# EAGLE schematic camera (EAGLE 6.5.0)
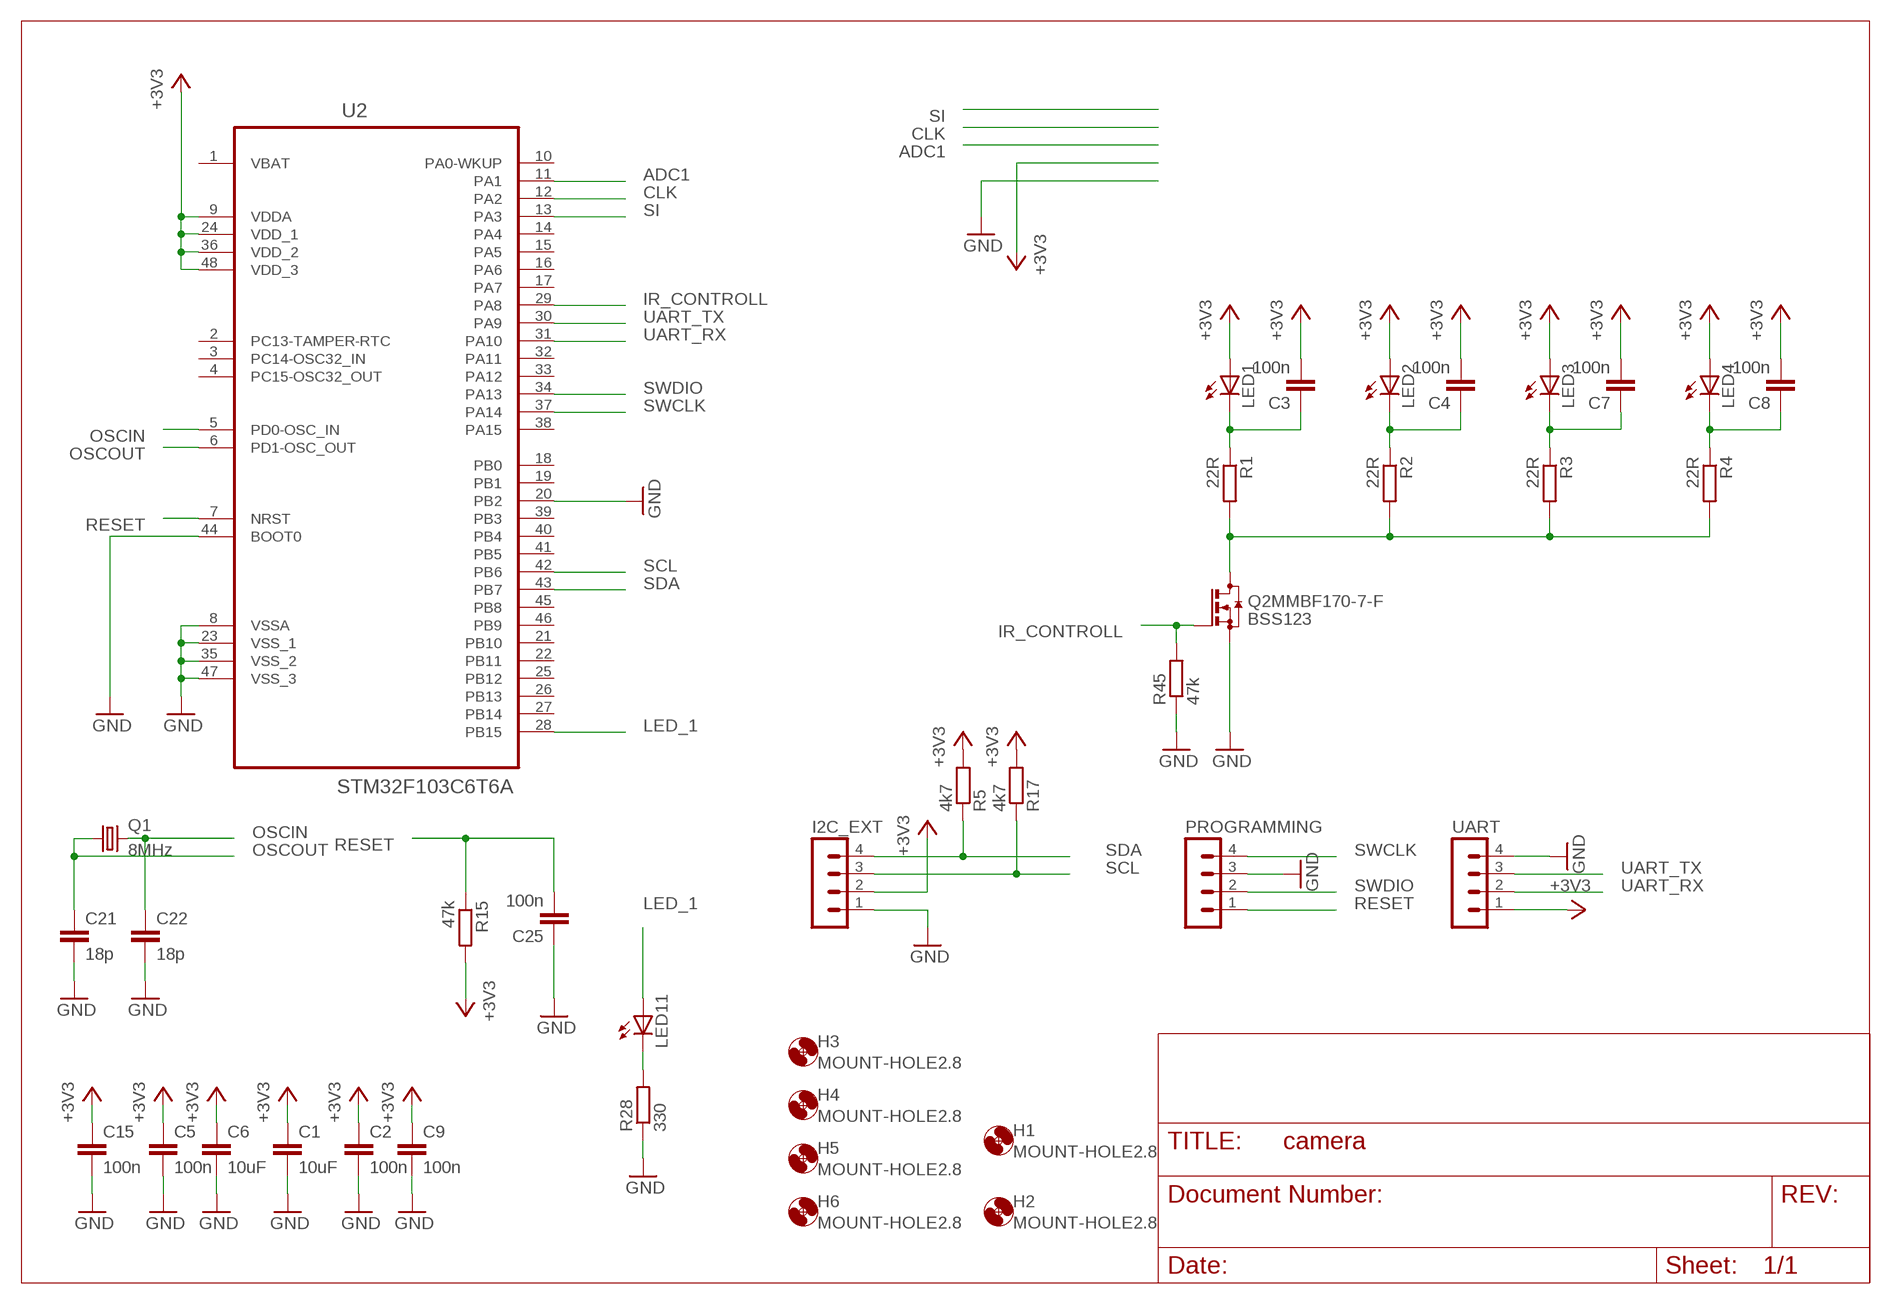
[diagram p0: schematic, sheet 1]

## Parts
C1  10uF  C-EUC0805  [C0805]
C2  100n  C-EUC0805  [C0805]
C3  100n  C-EUC0805  [C0805]
C4  100n  C-EUC0805  [C0805]
C5  100n  C-EUC0805  [C0805]
C6  10uF  C-EUC0805  [C0805]
C7  100n  C-EUC0805  [C0805]
C8  100n  C-EUC0805  [C0805]
C9  100n  C-EUC0805  [C0805]
C15  100n  C-EUC0805  [C0805]
C21  18p  C-EUC0805  [C0805]
C22  18p  C-EUC0805  [C0805]
C25  100n  C-EUC0805  [C0805]
H1  MOUNT-HOLE2.8  [2,8]
H2  MOUNT-HOLE2.8  [2,8]
H3  MOUNT-HOLE2.8  [2,8]
H4  MOUNT-HOLE2.8  [2,8]
H5  MOUNT-HOLE2.8  [2,8]
H6  MOUNT-HOLE2.8  [2,8]
I2C_EXT  MA04-1  [MA04-1]
LED1  LED5MM  [LED5MM]
LED2  LED5MM  [LED5MM]
LED3  LED5MM  [LED5MM]
LED4  LED5MM  [LED5MM]
LED11  LEDCHIPLED_1206  [CHIPLED_1206]
PROGRAMMING  MA04-1  [MA04-1]
Q1  8MHz  CRYSTALCTS406  [CTS406]
Q2MMBF170-7-F  BSS123  [SOT23]
R1  22R  R-EU_M0805  [M0805]
R2  22R  R-EU_M0805  [M0805]
R3  22R  R-EU_M0805  [M0805]
R4  22R  R-EU_M0805  [M0805]
R5  4k7  R-EU_M0805  [M0805]
R15  47k  R-EU_M0805  [M0805]
R17  4k7  R-EU_M0805  [M0805]
R28  330  R-EU_M0805  [M0805]
R45  47k  R-EU_M0805  [M0805]
U2  STM32F103C6T6A  [QFP50P900X900X160-48N]
UART  MA04-1  [MA04-1]

## Nets
+3V3: C1.1 C2.1 C3.2 C4.2 C5.1 C6.1 C7.2 C8.2 C9.1 C15.1 I2C_EXT.2 LED1.A LED2.A LED3.A LED4.A R5.2 R15.2 R17.2 U2.9(VDDA) U2.24(VDD_1) U2.36(VDD_2) U2.48(VDD_3) UART.1
ADC1: U2.11(PA1)
CLK: U2.12(PA2)
GND: C1.2 C2.2 C5.2 C6.2 C9.2 C15.2 C21.2 C22.2 C25.1 I2C_EXT.1 PROGRAMMING.3 Q2MMBF170-7-F.2(S) R28.1 R45.1 U2.8(VSSA) U2.20(PB2) U2.23(VSS_1) U2.35(VSS_2) U2.44(BOOT0) U2.47(VSS_3) UART.4
IR_CONTROLL: Q2MMBF170-7-F.1(G) R45.2 U2.29(PA8)
LED_1: LED11.A U2.28(PB15)
N$1: LED11.C R28.2
N$5: C3.1 LED1.K(C) R1.1
N$7: C4.1 LED2.K(C) R2.1
N$9: C7.1 LED3.K(C) R3.1
N$11: C8.1 LED4.K(C) R4.1
N$26: Q2MMBF170-7-F.3(D) R1.2 R2.2 R3.2 R4.2
OSCIN: C22.1 Q1.3 U2.5(PD0-OSC_IN)
OSCOUT: C21.1 Q1.1 U2.6(PD1-OSC_OUT)
RESET: C25.2 PROGRAMMING.1 R15.1 U2.7(NRST)
SCL: I2C_EXT.3 R17.1 U2.42(PB6)
SDA: I2C_EXT.4 R5.1 U2.43(PB7)
SI: U2.13(PA3)
SWCLK: PROGRAMMING.4 U2.37(PA14)
SWDIO: PROGRAMMING.2 U2.34(PA13)
UART_RX: U2.31(PA10) UART.2
UART_TX: U2.30(PA9) UART.3
Unconnected: U2.2(PC13-TAMPER-RTC) U2.3(PC14-OSC32_IN) U2.4(PC15-OSC32_OUT) U2.10(PA0-WKUP) U2.14(PA4) U2.15(PA5) U2.16(PA6) U2.17(PA7) U2.18(PB0) U2.19(PB1) U2.21(PB10) U2.22(PB11) U2.25(PB12) U2.26(PB13) U2.27(PB14) U2.32(PA11) U2.33(PA12) U2.38(PA15) U2.39(PB3) U2.40(PB4) U2.41(PB5) U2.45(PB8) U2.46(PB9)

## Power pins joined to a net without a drawn wire
VBAT: U2.1(VBAT)

## Library data of the parts
C1-C9 C15 C21 C22 C25 = resistor:C-EU: CAPACITOR, European symbol
H1-H6 = holes:MOUNT-HOLE: MOUNTING HOLE with drill center marker
I2C_EXT PROGRAMMING UART = con-lstb:MA04-1: PIN HEADER; OC_FARNELL: unknown; OC_NEWARK: unknown
LED1-LED4 LED11 = led:LED: LED OSRAM: - CHIPLED LG R971, LG N971, LY N971, LG Q971, LY Q971, LO R971, LY R971 LH N974, LH R974 LS Q976, LO Q976, LY Q976 LO Q996 - Hyper CHIPLED LW Q18S LB Q993, LB Q99A, LB R99A - SideLED LS A670, LO A670, LY A670, LG A670, LP A670 LB A673, LV A673, LT A673, LW A673 LH A674 LY A675 LS A676, LA A676, LO A676, LY A676, LW A676 LS A679, LY A679, LG A679 - Hyper Micro SIDELED® LS Y876, LA Y876, LO Y876, LY Y876 LT Y87S - SmartLED LW L88C, LW L88S LB L89C, LB L89S, LG L890 LS L89K, LO L89K, LY L89K LS L896, LA L896, LO L896, LY L896 - TOPLED LS T670, LO T670, LY T670, LG T670, LP T670 LSG T670, LSP T670, LSY T670, LOP T670, LYG T670 LG T671, LOG T671, LSG T671 LB T673, LV T673, LT T673, LW T673 LH T674 LS T676, LA T676, LO T676, LY T676, LB T676, LH T676, LSB T676, LW T676 LB T67C, LV T67C, LT T67C, LS T67K, LO T67K, LY T67K, LW E67C LS E67B, LA E67B, LO E67B, LY E67B, LB E67C, LV E67C, LT E67C LW T67C LS T679, LY T679, LG T679 LS T770, LO T770, LY T770, LG T770, LP T770 LB T773, LV T773, LT T773, LW T773 LH T774 LS E675, LA E675, LY E675, LS T675 LS T776, LA T776, LO T776, LY T776, LB T776 LHGB T686 LT T68C, LB T68C - Hyper Mini TOPLED® LB M676 - Mini TOPLED Santana® LG M470 LS M47K, LO M47K, LY M47K Source: http://www.osram.convergy.de LUXEON: - LUMILED® LXK2-PW12-R00, LXK2-PW12-S00, LXK2-PW14-U00, LXK2-PW14-V00 LXK2-PM12-R00, LXK2-PM12-S00, LXK2-PM14-U00 LXK2-PE12-Q00, LXK2-PE12-R00, LXK2-PE12-S00, LXK2-PE14-T00, LXK2-PE14-U00 LXK2-PB12-K00, LXK2-PB12-L00, LXK2-PB12-M00, LXK2-PB14-N00, LXK2-PB14-P00, LXK2-PB14-Q00 LXK2-PR12-L00, LXK2-PR12-M00, LXK2-PR14-Q00, LXK2-PR14-R00 LXK2-PD12-Q00, LXK2-PD12-R00, LXK2-PD12-S00 LXK2-PH12-R00, LXK2-PH12-S00 LXK2-PL12-P00, LXK2-PL12-Q00, LXK2-PL12-R00 Source: www.luxeon.com KINGBRIGHT: KA-3528ASYC Source: www.kingbright.com
Q1 = crystal:CRYSTAL: CRYSTAL; OC_FARNELL: unknown; OC_NEWARK: unknown
Q2MMBF170-7-F = transistor-small-signal:BSS123: N-CHANNEL MOS FET
R1-R5 R15 R17 R28 R45 = resistor:R-EU_: RESISTOR, European symbol
U2 = stm32f103_lqfp48:STM32F103C6T6A: MCU, 32BIT, 32K FLASH, 48LQFP; MPN: STM32F103C6T6A; OC_FARNELL: 1972391; OC_NEWARK: 72T2643; PACKAGE: 48LQFP; SUPPLIER: STMicroelectronics